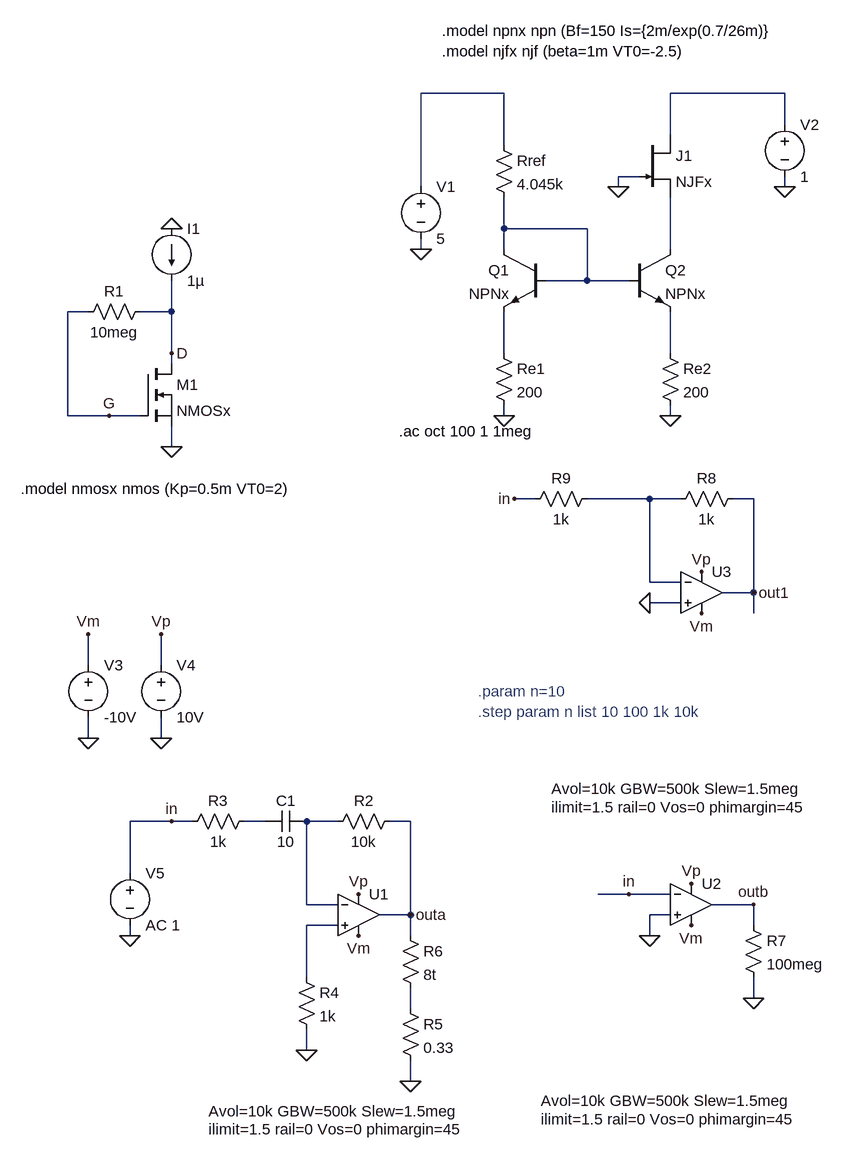
[diagram p0: schematic ws07_08.asc]
ws07_08.asc, the LTspice schematic file:
Version 4
SHEET 1 880 1580
WIRE 48 -48 -80 -48
WIRE 480 -48 304 -48
WIRE 480 0 480 -48
WIRE 304 16 304 -48
WIRE 48 32 48 -48
WIRE 256 80 224 80
WIRE -80 96 -80 -48
WIRE 224 96 224 80
WIRE 480 96 480 80
WIRE 48 160 48 112
WIRE 176 160 48 160
WIRE -80 192 -80 176
WIRE 48 192 48 160
WIRE 304 192 304 112
WIRE 176 240 176 160
WIRE 176 240 112 240
WIRE 240 240 176 240
WIRE -592 288 -624 288
WIRE -464 288 -464 240
WIRE -464 288 -512 288
WIRE -464 352 -464 288
WIRE 48 352 48 288
WIRE 304 352 304 288
WIRE -464 368 -464 352
WIRE -624 448 -624 288
WIRE -560 448 -624 448
WIRE -512 448 -560 448
WIRE 48 448 48 432
WIRE 304 448 304 432
WIRE -464 496 -464 464
WIRE 96 576 64 576
WIRE 272 576 176 576
WIRE 320 576 272 576
WIRE 432 576 400 576
WIRE 272 704 272 576
WIRE 320 704 272 704
WIRE 432 720 432 576
WIRE 432 720 384 720
WIRE 320 736 272 736
WIRE 432 752 432 720
WIRE -592 832 -592 784
WIRE -480 832 -480 784
WIRE -592 944 -592 912
WIRE -480 944 -480 912
WIRE -464 1072 -528 1072
WIRE -432 1072 -464 1072
WIRE -320 1072 -352 1072
WIRE -208 1072 -256 1072
WIRE -96 1072 -128 1072
WIRE -528 1152 -528 1072
WIRE 240 1184 192 1184
WIRE 304 1184 240 1184
WIRE -256 1200 -256 1072
WIRE -208 1200 -256 1200
WIRE 432 1200 368 1200
WIRE -96 1216 -96 1072
WIRE -96 1216 -144 1216
WIRE 304 1216 272 1216
WIRE -208 1232 -256 1232
WIRE 432 1232 432 1200
WIRE -528 1248 -528 1232
WIRE -96 1248 -96 1216
WIRE 272 1248 272 1216
WIRE -256 1312 -256 1232
WIRE 432 1344 432 1312
WIRE -96 1360 -96 1328
WIRE -256 1424 -256 1392
WIRE -96 1472 -96 1440
FLAG 48 448 0
FLAG 304 448 0
FLAG -80 192 0
FLAG 480 96 0
FLAG 224 96 0
FLAG -464 496 0
FLAG -464 160 0
FLAG -464 352 D
FLAG -560 448 G
FLAG -592 944 0
FLAG -480 944 0
FLAG -480 784 Vp
FLAG -592 784 Vm
FLAG -176 1248 Vm
FLAG -176 1184 Vp
FLAG -528 1248 0
FLAG -256 1424 0
FLAG -96 1472 0
FLAG 336 1232 Vm
FLAG 336 1168 Vp
FLAG 272 1248 0
FLAG 432 1344 0
FLAG 240 1184 in
FLAG -464 1072 in
FLAG 352 752 Vm
FLAG 352 688 Vp
FLAG 64 576 in
FLAG 272 736 0
FLAG 432 720 out1
FLAG -96 1216 outa
FLAG 432 1200 outb
SYMBOL voltage -80 80 R0
SYMATTR InstName V1
SYMATTR Value 5
SYMBOL voltage 480 -16 R0
SYMATTR InstName V2
SYMATTR Value 1
SYMBOL npn 112 192 M0
SYMATTR InstName Q1
SYMATTR Value NPNx
SYMBOL npn 240 192 R0
SYMATTR InstName Q2
SYMATTR Value NPNx
SYMBOL njf 256 16 R0
SYMATTR InstName J1
SYMATTR Value NJFx
SYMBOL res 288 336 R0
SYMATTR InstName Re2
SYMATTR Value 200
SYMBOL res 32 336 R0
SYMATTR InstName Re1
SYMATTR Value 200
SYMBOL res 32 16 R0
SYMATTR InstName Rref
SYMATTR Value 4.045k
SYMBOL nmos -512 368 R0
SYMATTR InstName M1
SYMATTR Value NMOSx
SYMBOL res -496 272 R90
WINDOW 0 0 56 VBottom 2
WINDOW 3 32 56 VTop 2
SYMATTR InstName R1
SYMATTR Value 10meg
SYMBOL current -464 160 R0
SYMATTR InstName I1
SYMATTR Value 1µ
SYMBOL Opamps\\UniversalOpamp2 -176 1216 R0
WINDOW 123 -231 302 Left 2
WINDOW 39 -231 330 Left 2
SYMATTR InstName U1
SYMATTR Value2 Avol=10k GBW=500k Slew=1.5meg
SYMATTR SpiceLine ilimit=1.5 rail=0 Vos=0 phimargin=45
SYMBOL voltage -592 816 R0
SYMATTR InstName V3
SYMATTR Value -10V
SYMBOL voltage -480 816 R0
WINDOW 123 0 0 Left 2
WINDOW 39 0 0 Left 2
SYMATTR InstName V4
SYMATTR Value 10V
SYMBOL res -112 1056 R90
WINDOW 0 0 56 VBottom 2
WINDOW 3 32 56 VTop 2
SYMATTR InstName R2
SYMATTR Value 10k
SYMBOL res -336 1056 R90
WINDOW 0 0 56 VBottom 2
WINDOW 3 32 56 VTop 2
SYMATTR InstName R3
SYMATTR Value 1k
SYMBOL cap -256 1056 R90
WINDOW 0 0 32 VBottom 2
WINDOW 3 32 32 VTop 2
SYMATTR InstName C1
SYMATTR Value 10
SYMBOL res -272 1296 R0
SYMATTR InstName R4
SYMATTR Value 1k
SYMBOL voltage -528 1136 R0
SYMATTR InstName V5
SYMATTR Value AC 1
SYMBOL res -112 1344 R0
SYMATTR InstName R5
SYMATTR Value 0.33
SYMBOL res -112 1232 R0
SYMATTR InstName R6
SYMATTR Value 8t
SYMBOL Opamps\\UniversalOpamp2 336 1200 R0
WINDOW 123 -231 302 Left 2
WINDOW 39 -231 330 Left 2
SYMATTR InstName U2
SYMATTR Value2 Avol=10k GBW=500k Slew=1.5meg
SYMATTR SpiceLine ilimit=1.5 rail=0 Vos=0 phimargin=45
SYMBOL res 416 1216 R0
SYMATTR InstName R7
SYMATTR Value 100meg
SYMBOL Opamps\\UniversalOpamp2 352 720 R0
WINDOW 123 -231 302 Left 2
WINDOW 39 -231 330 Left 2
SYMATTR InstName U3
SYMATTR Value2 Avol=10k GBW=500k Slew=1.5meg
SYMATTR SpiceLine ilimit=1.5 rail=0 Vos=0 phimargin=45
SYMBOL res 416 560 R90
WINDOW 0 0 56 VBottom 2
WINDOW 3 32 56 VTop 2
SYMATTR InstName R8
SYMATTR Value 1k
SYMBOL res 192 560 R90
WINDOW 0 0 56 VBottom 2
WINDOW 3 32 56 VTop 2
SYMATTR InstName R9
SYMATTR Value 1k
TEXT -114 472 Left 2 !.ac oct 100 1 1meg
TEXT -48 -144 Left 2 !.model npnx npn (Bf=150 Is={2m/exp(0.7/26m)}\n.model njfx njf (beta=1m VT0=-2.5)
TEXT -696 560 Left 2 !.model nmosx nmos (Kp=0.5m VT0=2)
TEXT 8 872 Left 2 ;.param n=10\n.step param n list 10 100 1k 10k

The netlist it stands for:
* ws07_08.asc
V1 N001 0 5
V2 N002 0 1
Q1 N003 N003 N005 0 NPNx
Q2 N004 N003 N006 0 NPNx
J1 N002 0 N004 NJFx
Re2 N006 0 200
Re1 N005 0 200
Rref N001 N003 4.045k
M1 D G 0 0 NMOSx
R1 D G 10meg
I1 0 D 1µ
XU1 N010 N009 Vp Vm outa level.2 Avol=10k GBW=500k Slew=1.5meg ilimit=1.5 rail=0 Vos=0 phimargin=45 en=0 enk=0 in=0 ink=0 Rin=500Meg  ; pins IN+ IN- V+ V- OUT
V3 Vm 0 -10V
V4 Vp 0 10V
R2 outa N009 10k
R3 N008 in 1k
C1 N009 N008 10
R4 N010 0 1k
V5 in 0 AC 1
R5 N011 0 0.33
R6 outa N011 8t
XU2 0 in Vp Vm outb level.2 Avol=10k GBW=500k Slew=1.5meg ilimit=1.5 rail=0 Vos=0 phimargin=45 en=0 enk=0 in=0 ink=0 Rin=500Meg  ; pins IN+ IN- V+ V- OUT
R7 outb 0 100meg
XU3 0 N007 Vp Vm out1 level.2 Avol=10k GBW=500k Slew=1.5meg ilimit=1.5 rail=0 Vos=0 phimargin=45 en=0 enk=0 in=0 ink=0 Rin=500Meg  ; pins IN+ IN- V+ V- OUT
R8 out1 N007 1k
R9 N007 in 1k
.model NPN NPN
.model PNP PNP
.lib standard.bjt
.model NJF NJF
.model PJF PJF
.lib standard.jft
.model NMOS NMOS
.model PMOS PMOS
.lib standard.mos
.ac oct 100 1 1meg
.model npnx npn (Bf=150 Is={2m/exp(0.7/26m)}
.model njfx njf (beta=1m VT0=-2.5)
.model nmosx nmos (Kp=0.5m VT0=2)
* .param n=10
* .step param n list 10 100 1k 10k
.lib UniversalOpamps2.sub
.backanno
.end